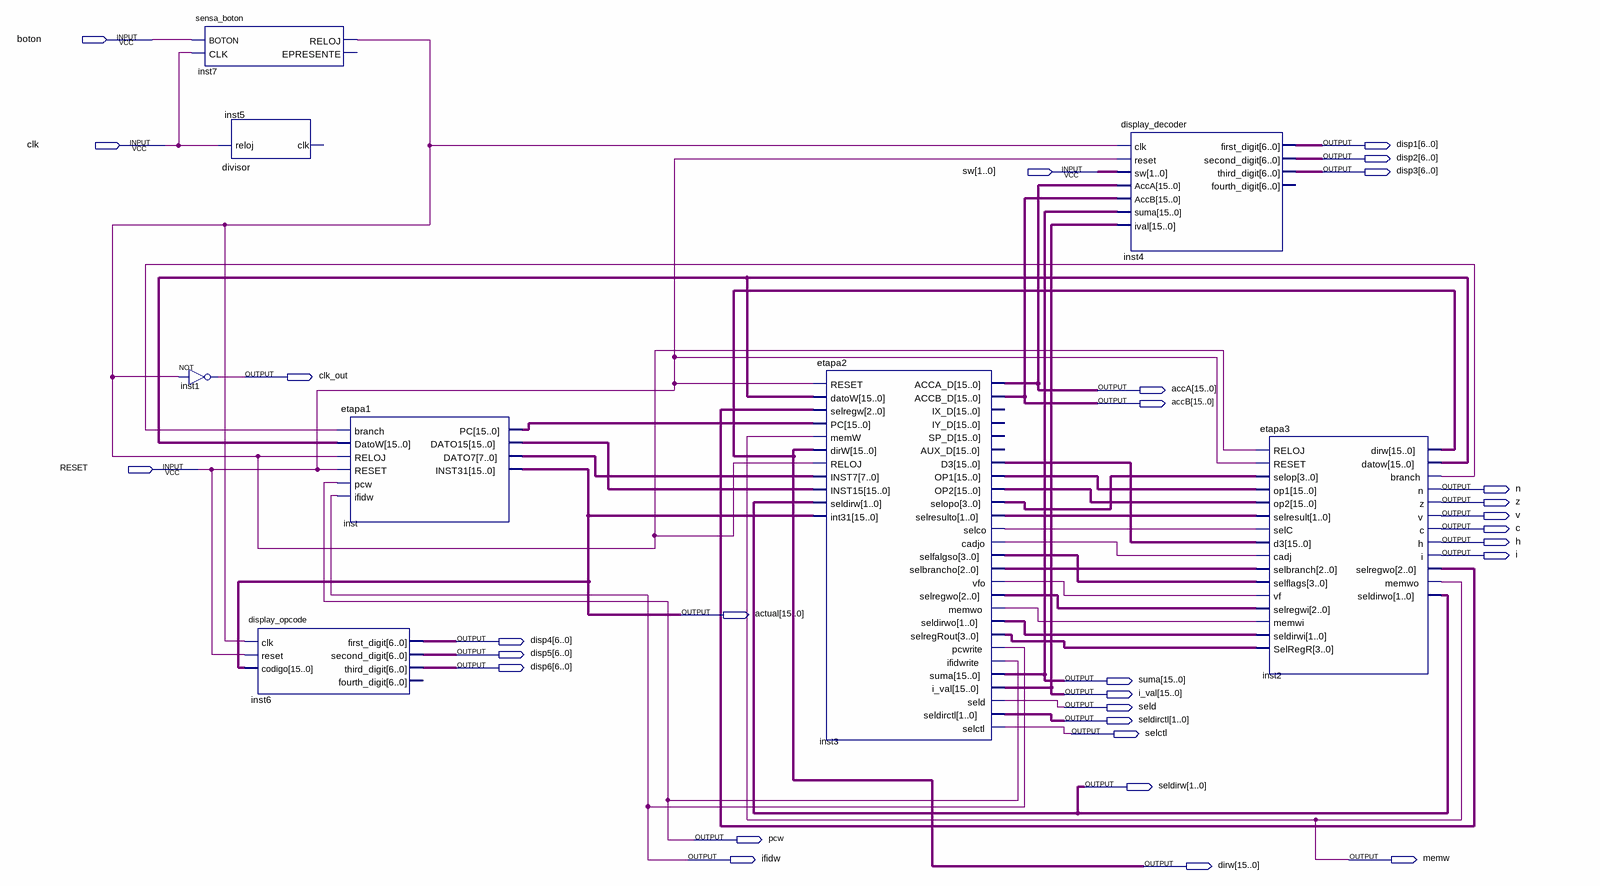
[diagram p0: schematic sheet]
// Quartus schematic pipeline.bdf as structural Verilog: 8 symbols, 30 pins
module pipeline (
  input  boton,
  input  clk,
  input  [1:0] sw,
  input  RESET,
  output [6:0] disp1,
  output [6:0] disp2,
  output [6:0] disp3,
  output clk_out,
  output [15:0] accA,
  output [15:0] accB,
  output n,
  output z,
  output v,
  output c,
  output h,
  output i,
  output [15:0] actual,
  output [6:0] disp4,
  output [6:0] disp5,
  output [6:0] disp6,
  output [15:0] suma,
  output [15:0] i_val,
  output seld,
  output [1:0] seldirctl,
  output selctl,
  output [1:0] seldirw,
  output pcw,
  output ifidw,
  output memw,
  output [15:0] dirw
);

  wire inst2_branch, inst3_cadjo, inst3_memwo, inst3_selco, inst3_vfo, inst7_reloj;
  wire [1:0] inst3_seldirwo, inst3_selresulto;
  wire [2:0] inst2_selregwo, inst3_selbrancho, inst3_selregwo;
  wire [3:0] inst3_selfalgso, inst3_selopo, inst3_selregrout;
  wire [7:0] inst_dato7;
  wire [15:0] inst2_datow, inst3_d3, inst3_op1, inst3_op2, inst_dato15, inst_pc;

  sensa_boton inst7 (.BOTON(boton), .CLK(clk), .RELOJ(inst7_reloj));  // open: EPRESENTE
  not inst1 (clk_out, inst7_reloj);
  divisor inst5 (.reloj(clk));  // open: clk
  display_opcode inst6 (
    .clk(inst7_reloj), .reset(RESET), .codigo(actual), .first_digit(disp4), .second_digit(disp5),
    .third_digit(disp6));  // open: fourth_digit
  etapa1 inst (
    .branch(inst2_branch), .DatoW(inst2_datow), .RELOJ(inst7_reloj), .RESET(RESET), .pcw(pcw), .ifidw(ifidw),
    .PC(inst_pc), .DATO15(inst_dato15), .DATO7(inst_dato7), .INST31(actual));
  etapa2 inst3 (
    .RESET(RESET), .datoW(inst2_datow), .selregw(inst2_selregwo), .PC(inst_pc), .memW(memw), .dirW(dirw),
    .RELOJ(inst7_reloj), .INST7(inst_dato7), .INST15(inst_dato15), .seldirw(seldirw), .int31(actual),
    .ACCA_D(accA), .ACCB_D(accB), .D3(inst3_d3), .OP1(inst3_op1), .OP2(inst3_op2), .selopo(inst3_selopo),
    .selresulto(inst3_selresulto), .selco(inst3_selco), .cadjo(inst3_cadjo), .selfalgso(inst3_selfalgso),
    .selbrancho(inst3_selbrancho), .vfo(inst3_vfo), .selregwo(inst3_selregwo), .memwo(inst3_memwo),
    .seldirwo(inst3_seldirwo), .selregRout(inst3_selregrout), .pcwrite(ifidw), .ifidwrite(pcw), .suma(suma),
    .i_val(i_val), .seld(seld), .seldirctl(seldirctl), .selctl(selctl));  // open: IX_D, IY_D, SP_D, AUX_D
  display_decoder inst4 (
    .clk(inst7_reloj), .reset(RESET), .sw(sw), .AccA(accA), .AccB(accB), .suma(suma), .ival(i_val),
    .first_digit(disp1), .second_digit(disp2), .third_digit(disp3));  // open: fourth_digit
  etapa3 inst2 (
    .RELOJ(inst7_reloj), .op1(inst3_op1), .RESET(RESET), .selop(inst3_selopo), .op2(inst3_op2),
    .SelRegR(inst3_selregrout), .selresult(inst3_selresulto), .d3(inst3_d3), .selbranch(inst3_selbrancho),
    .selflags(inst3_selfalgso), .selC(inst3_selco), .cadj(inst3_cadjo), .vf(inst3_vfo),
    .selregwi(inst3_selregwo), .memwi(inst3_memwo), .seldirwi(inst3_seldirwo), .dirw(dirw),
    .datow(inst2_datow), .branch(inst2_branch), .n(n), .z(z), .v(v), .c(c), .h(h), .i(i),
    .selregwo(inst2_selregwo), .memwo(memw), .seldirwo(seldirw));
endmodule
